# EAGLE design main_board (EAGLE 8.7.1)
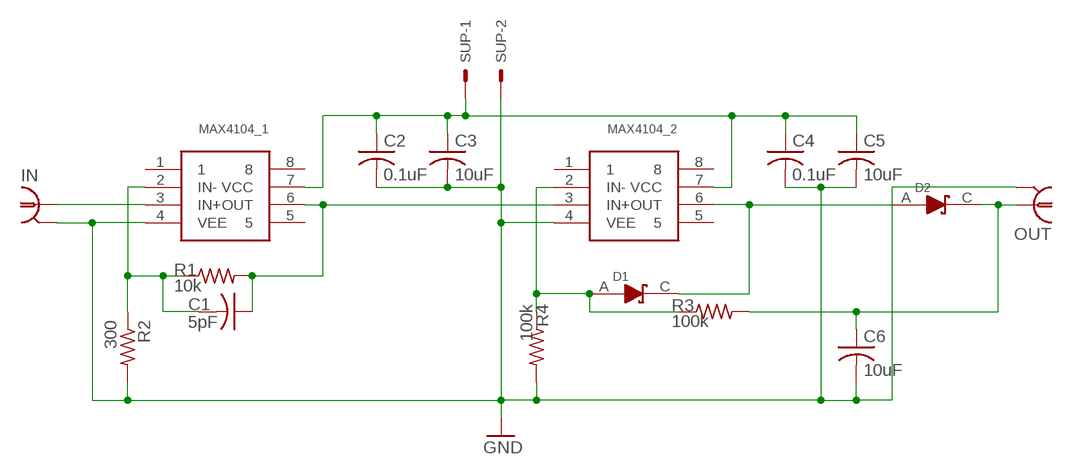
[diagram p0: schematic, sheet 1]

## Parts
C1  5pF  C-USC0805  [C0805]
C2  0.1uF  C-USC0805  [C0805]
C3  10uF  C-USC0805  [C0805]
C4  0.1uF  C-USC0805  [C0805]
C5  10uF  C-USC0805  [C0805]
C6  10uF  C-USC0805  [C0805]
D1  SCH_D1  [SML0805]
D2  SCH_D1  [SML0805]
IN  LTI-SASF54GT  [LTI-SASF54GT]
MAX4104_1  MAX4104  [SO8]
MAX4104_2  MAX4104  [SO8]
OUT  LTI-SASF54GT  [LTI-SASF54GT]
R1  10k  R-US_M0805  [M0805]
R2  300  R-US_M0805  [M0805]
R3  100k  R-US_M0805  [M0805]
R4  100k  R-US_M0805  [M0805]
SUP  332-02  [332-02]

## Nets
AMP: C1.1 MAX4104_1.6(OUT) MAX4104_2.3(IN+) R1.2
DIG_READOUT: C6.1 D2.C(OUT) OUT.1 R3.2
GND: C2.2 C3.2 C4.2 C5.2 C6.2 IN.2 IN.3 IN.4 IN.5 MAX4104_1.4(VEE) MAX4104_2.4(VEE) OUT.2 OUT.3 OUT.4 OUT.5 R2.2 R4.2 SUP.2
IN: IN.1 MAX4104_1.3(IN+)
IN-_1: C1.2 MAX4104_1.2(IN-) R1.1 R2.1
IN-_2: D1.A(IN) MAX4104_2.2(IN-) R3.1 R4.1
OUT_2: D1.C(OUT) D2.A(IN) MAX4104_2.6(OUT)
VCC: C2.1 C3.1 C4.1 C5.1 MAX4104_1.7(VCC) MAX4104_2.7(VCC) SUP.1
Unconnected: MAX4104_1.1 MAX4104_1.5 MAX4104_1.8 MAX4104_2.1 MAX4104_2.5 MAX4104_2.8

## Library data of the parts
C1-C6 = rcl:C-US: CAPACITOR, American symbol; SPICEPREFIX: C
D1 D2 = 000phys605parts:SCH_D1
IN OUT = con-coax:LTI-SASF54GT: SMA vertical PCB thrue hole jack Source: Lighthorse Technologies, inc. SASF54GT.pdf; OC_FARNELL: unknown; OC_NEWARK: unknown
MAX4104_1 MAX4104_2 = 000phys605parts:MAX4104
R1-R4 = rcl:R-US_: RESISTOR, American symbol; SPICEPREFIX: R
SUP = con-garry:332-02: 2 Pin - 2mm Dual Row Source: www.mpe-connector.de / garry_shortform_2012.pdf

## Board
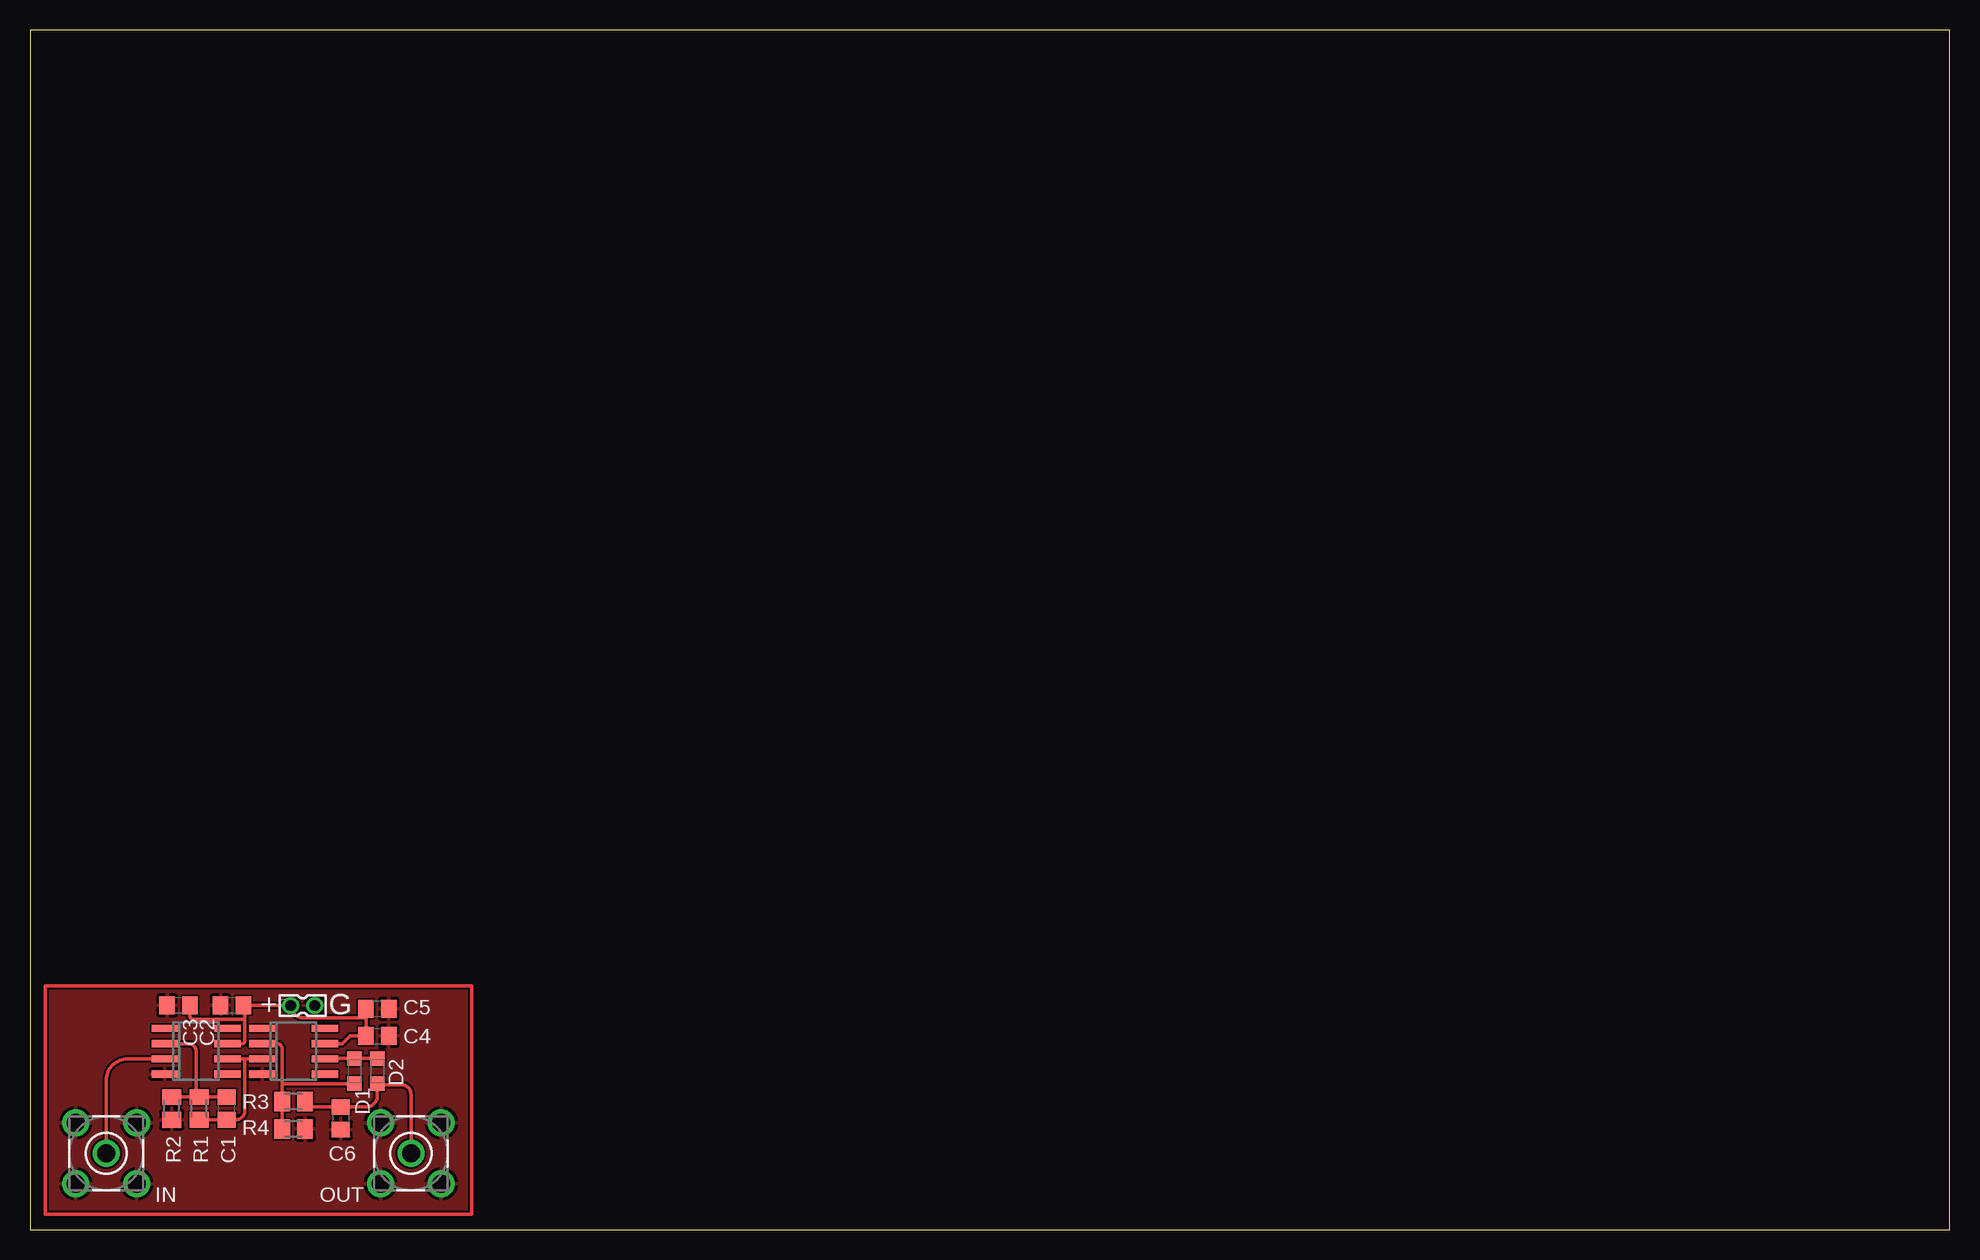
[diagram p1: board, top side]

Size 160 x 100 mm. Coordinates in mm from the lower left corner, seen from the top.
Outline: 0,0 160,0 160,100 0,100 0,0
Copper layers (1*16): Top 0.035mm / dielectric 1.5mm / Bottom 0.035mm
Design rules "default": minimum track width 6mil, minimum drill 0.35mm, track to track 6mil, track to pad 6mil, pad to pad 6mil, via to via 6mil, smd to smd 6mil, copper to edge 40mil, drill to drill 6mil, minimum pad ring 10mil, minimum via ring 8mil, stop-mask expansion 4mil, vias tented up to drill 0mil, thermal gap 10mil

### Footprints (pad centres in the part's own frame; a part is rotated, then mirrored left to right if it is on the bottom)
C0805 = smd 1.3 x 1.5: 1 -0.95,0; 2 0.95,0
SML0805 = smd 1.2 x 1.2: A 1.05,0; C -1.05,0
LTI-SASF54GT = drill 1.5 pad 2.2: 1 0,0; 2 -2.54,2.54; 3 2.54,2.54; 4 2.54,-2.54; 5 -2.54,-2.54
SO8 = smd 0.6 x 2.2: 1 -1.905,-2.6; 2 -0.635,-2.6; 3 0.635,-2.6; 4 1.905,-2.6; 5 1.905,2.6; 6 0.635,2.6; 7 -0.635,2.6; 8 -1.905,2.6
M0805 = smd 1.3 x 1.6: 1 -0.95,0; 2 0.95,0
332-02 = drill 0.9 pad 1.27: 1 0,-1; 2 0,1

### Placement (x,y rotation side)
C1  16.38,10.1 90 top
C2  16.83,18.67 180 top
C3  12.38,18.67 180 top
C4  28.96,16.13 0 top
C5  28.96,18.41 0 top
C6  25.91,9.27 270 top
D1  27.05,13.21 270 top
D2  28.96,13.21 90 top
IN  6.35,6.35 180 top
MAX4104_1  13.84,14.86 270 top
MAX4104_2  21.97,14.86 270 top
OUT  31.75,6.35 0 top
R1  14.1,10.1 270 top
R2  11.81,10.1 270 top
R3  21.97,10.67 0 top
R4  21.97,8.38 0 top
SUP  22.73,18.67 270 top

### Tracks (layer width: path | path; a pad name or v marks a point on that pad's centre or on a via)
AMP
  Top 0.305: MAX4104_1.6 17.91,14.22 | 17.91,14.22 MAX4104_2.3 | R1.2 C1.1 17.15,9.15 arc90 17.91,9.91 17.91,14.22
DIG_READOUT
  Top 0.305: R3.2 arc90 23.37,10.22 C6.1 28,10.22 arc90 28.96,11.18 28.96,11.97 arc-90 29.05,12.06 | D2.C arc90 29.05,12.06 | 29.05,12.06 30.99,12.06 arc-90 31.75,11.3 OUT.1
GND
  pour Top: 0,21.59 0,0 36.83,0 36.83,21.59
IN
  Top 0.305: MAX4104_1.3 8.13,14.22 arc90 6.35,12.45 IN.1
IN-_1
  Top 0.305: R2.1 13.84,11.05 | 13.84,11.05 R1.1 C1.2 | MAX4104_1.2 13.21,15.49 arc-90 13.84,14.86 13.84,11.05
IN-_2
  Top 0.305: R4.1 R3.1 21.02,12.32 | 21.02,12.32 21.02,15.05 arc90 20.57,15.49 MAX4104_2.2 | D1.A 21.18,12.16 arc-90 21.02,12.32
N$1
  Top 0.305: 1.27,20.32 1.27,1.27 36.83,1.27 36.83,20.32 1.27,20.32
OUT_2
  Top 0.305: MAX4104_2.6 arc-90 24.61,14.26 D1.C D2.A
VCC
  Top 0.305: C5.1 28.01,17.65 | 28.01,17.65 C4.1 26.67,16.13 26.04,15.49 MAX4104_2.7 | MAX4104_1.7 17.65,15.49 arc90 17.91,15.75 17.91,17.4 | 17.91,18.54 arc90 C2.1 | 17.91,17.4 17.91,18.54 | 17.91,18.54 arc-90 18.04,18.67 SUP.1 arc90 22.75,17.65 28.01,17.65 | C3.1 13.33,17.78 arc90 13.59,17.53 17.78,17.53 arc-90 17.91,17.4

### Text on the board
tNames: + | G